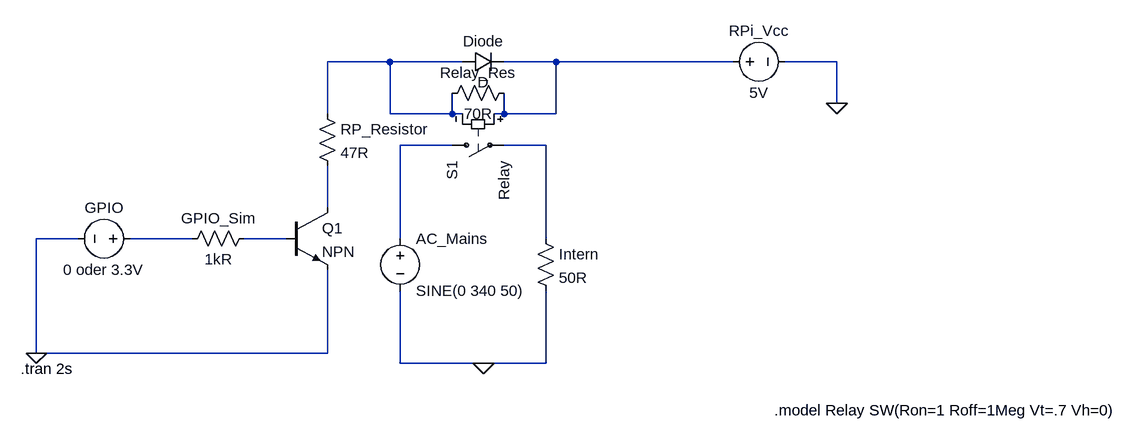
[diagram p0: schematic Switch_Circuit.asc]
Switch_Circuit.asc, the LTspice schematic file:
Version 4
SHEET 1 1540 680
WIRE 304 -128 208 -128
WIRE 416 -128 304 -128
WIRE 560 -128 480 -128
WIRE 832 -128 560 -128
WIRE 992 -128 912 -128
WIRE 992 -64 992 -128
WIRE 208 -48 208 -128
WIRE 304 -48 304 -128
WIRE 400 -48 400 -80
WIRE 400 -48 304 -48
WIRE 416 -48 400 -48
WIRE 480 -48 480 -80
WIRE 480 -48 464 -48
WIRE 560 -48 560 -128
WIRE 560 -48 480 -48
WIRE 400 0 320 0
WIRE 544 0 480 0
WIRE 208 96 208 32
WIRE -176 144 -240 144
WIRE 0 144 -96 144
WIRE 144 144 80 144
WIRE 320 144 320 0
WIRE 544 144 544 0
WIRE -240 320 -240 144
WIRE 208 320 208 192
WIRE 208 320 -240 320
WIRE 320 336 320 224
WIRE 448 336 320 336
WIRE 544 336 544 224
WIRE 544 336 448 336
FLAG -240 320 0
FLAG 992 -64 0
FLAG 448 336 0
SYMBOL npn 144 96 R0
SYMATTR InstName Q1
SYMBOL voltage -80 144 R90
WINDOW 0 -32 56 VBottom 2
WINDOW 3 32 56 VTop 2
WINDOW 123 0 0 Left 2
WINDOW 39 0 0 Left 2
SYMATTR InstName GPIO
SYMATTR Value 0 oder 3.3V
SYMBOL voltage 816 -128 R270
WINDOW 0 32 56 VTop 2
WINDOW 3 -32 56 VBottom 2
WINDOW 123 0 0 Left 2
WINDOW 39 0 0 Left 2
SYMATTR InstName RPi_Vcc
SYMATTR Value 5V
SYMBOL res 96 128 R90
WINDOW 0 0 56 VBottom 2
WINDOW 3 32 56 VTop 2
SYMATTR InstName GPIO_Sim
SYMATTR Value 1kR
SYMBOL diode 416 -112 R270
WINDOW 0 32 32 VTop 2
WINDOW 3 0 32 VBottom 2
SYMATTR InstName Diode
SYMBOL sw 384 0 M90
SYMATTR InstName S1
SYMATTR Value Relay
SYMBOL voltage 320 128 R0
WINDOW 123 0 0 Left 2
WINDOW 39 0 0 Left 2
SYMATTR InstName AC_Mains
SYMATTR Value SINE(0 340 50)
SYMBOL res 528 128 R0
SYMATTR InstName Intern
SYMATTR Value 50R
SYMBOL res 496 -96 R90
WINDOW 0 0 56 VBottom 2
WINDOW 3 32 56 VTop 2
SYMATTR InstName Relay_Res
SYMATTR Value 70R
SYMBOL res 192 -64 R0
SYMATTR InstName RP_Resistor
SYMATTR Value 47R
TEXT -264 344 Left 2 !.tran 2s
TEXT 896 408 Left 2 !.model Relay SW(Ron=1 Roff=1Meg Vt=.7 Vh=0)

The netlist it stands for:
* Switch_Circuit.asc
Q1 N005 N007 0 0 NPN
V§GPIO N006 0 0 oder 3.3V
V§RPi_Vcc N002 0 5V
R§GPIO_Sim N007 N006 1kR
Diode N001 N002 D
S1 N003 N004 N002 N001 Relay
V§AC_Mains N003 0 SINE(0 340 50)
R§Intern N004 0 50R
Relay_Res N002 N001 70R
RP_Resistor N001 N005 47R
.model D D
.lib standard.dio
.model NPN NPN
.model PNP PNP
.lib standard.bjt
.tran 2s
.model Relay SW(Ron=1 Roff=1Meg Vt=.7 Vh=0)
.backanno
.end